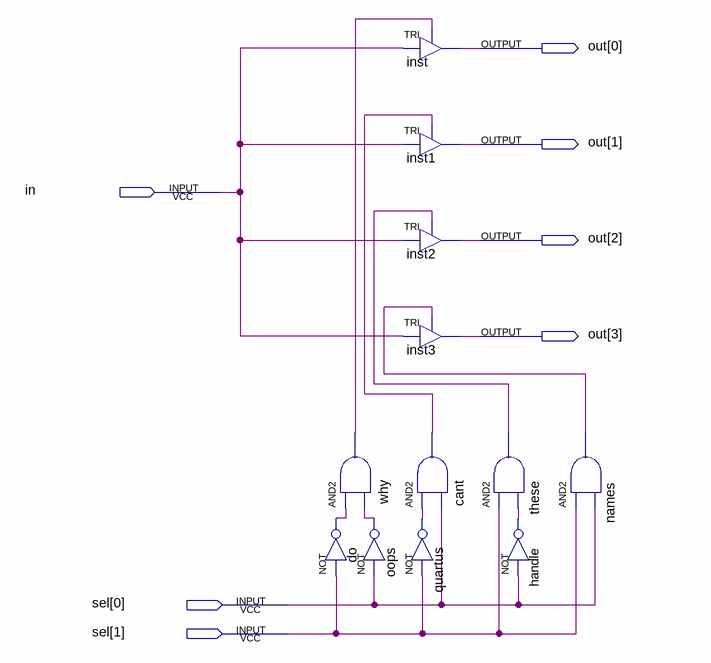
[diagram p0: schematic sheet]
// Quartus schematic mux1to4.bdf as structural Verilog: 12 symbols, 7 pins
module mux1to4 (
  input  in,
  input  [1:0] sel,
  output [3:0] out
);

  wire cant_out, do_out, handle_out, names_out, oops_out, quartus_out, these_out, why_out;

  and why (why_out, do_out, oops_out);
  not \do  (do_out, sel[1]);
  TRI inst (.IN(in), .OE(why_out), .OUT(out[0]));
  TRI inst1 (.IN(in), .OE(cant_out), .OUT(out[1]));
  TRI inst2 (.IN(in), .OE(these_out), .OUT(out[2]));
  TRI inst3 (.IN(in), .OE(names_out), .OUT(out[3]));
  and cant (cant_out, quartus_out, sel[0]);
  not quartus (quartus_out, sel[1]);
  not oops (oops_out, sel[0]);
  and these (these_out, sel[1], handle_out);
  not handle (handle_out, sel[0]);
  and names (names_out, sel[1], sel[0]);
endmodule
